# Altium project Basic_Board.PrjPcb
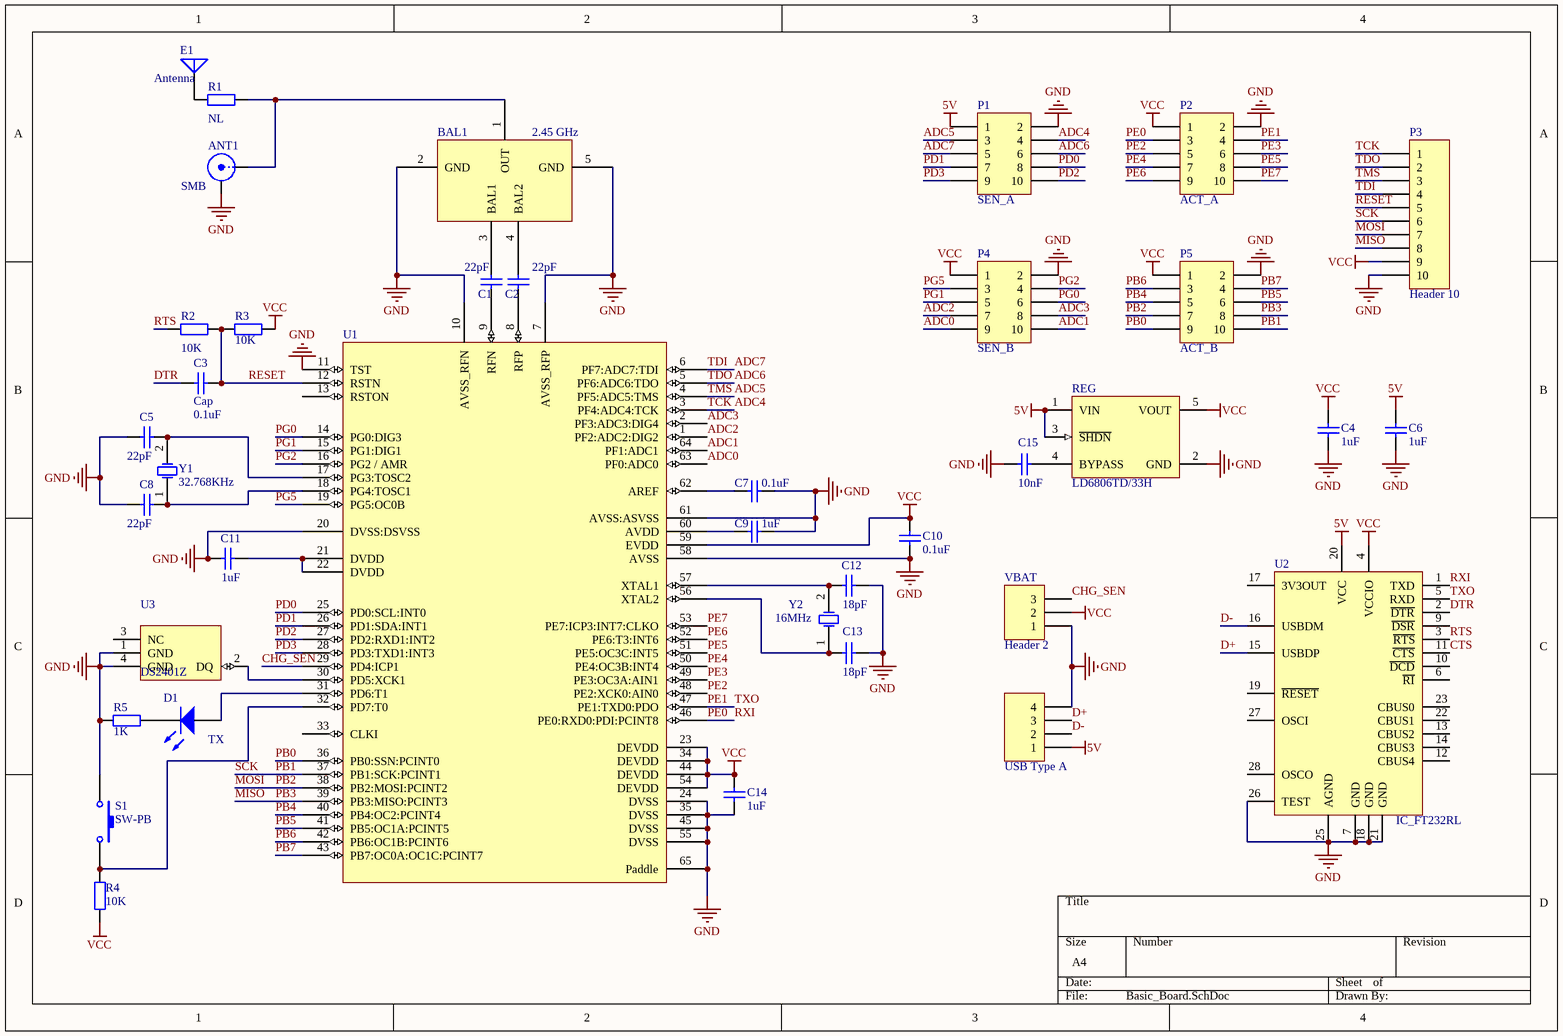
[diagram p0: Basic_Board.SchDoc]
1 sheet, 38 parts. Net scope: global (net labels, ports and power ports of the same name join across sheets).
Board file: Basic_Board.PcbDoc

## Sheet Basic_Board.SchDoc
size A4

### Parts
ANT1  SMB  [U.FL-R-SMT]
BAL1  2.45 GHz  [BALUN_SMD]
C1  value 22pF  [1608[0603]]  (hidden comment: Cap)
C2  value 22pF  [1608[0603]]  (hidden comment: Cap)
C3  Cap  value 0.1uF  [1608[0603]]
C4  value 1uF  [1608[0603]]  (hidden comment: Cap)
C5  value 22pF  [1608[0603]]  (hidden comment: Cap)
C6  value 1uF  [1608[0603]]  (hidden comment: Cap)
C7  value 0.1uF  [1608[0603]]  (hidden comment: Cap)
C8  value 22pF  [1608[0603]]  (hidden comment: Cap)
C9  value 1uF  [1608[0603]]  (hidden comment: Cap)
C10  value 0.1uF  [1608[0603]]  (hidden comment: Cap)
C11  value 1uF  [1608[0603]]  (hidden comment: Cap)
C12  value 18pF  [1608[0603]]  (hidden comment: Cap)
C13  value 18pF  [1608[0603]]  (hidden comment: Cap)
C14  value 1uF  [1608[0603]]  (hidden comment: Cap)
C15  value 10nF  [1608[0603]]  (hidden comment: Cap)
D1  TX  [3015[1206]]
E1  Antenna  [Antennas 2.4G SMD MOLEX]
P1  SEN_A  [HDR2X5_Female_Slim]
P2  ACT_A  [HDR2X5_Female_Slim]
P3  Header 10  [HDR1X10]
P4  SEN_B  [HDR2X5_Female_Slim]
P5  ACT_B  [HDR2X5_Female_Slim]
P7  USB Type A  [USBA_SMD]
R1  value NL  [1608[0603]]  (hidden comment: Res2)
R2  value 10K  [1608[0603]]  (hidden comment: Res2)
R3  value 10K  [1608[0603]]  (hidden comment: Res2)
R4  value 10K  [1608[0603]]  (hidden comment: Res2)
R5  value 1K  [1608[0603]]  (hidden comment: Res2)
REG  LD6806TD/33H  [DBV005_N]
S1  SW-PB  [BUTTON SWITCH]
U1  ATmega128RFA1-DE  [MLF64-M2]  (value not drawn)
U2  IC_FT232RL  [SSOP-28]
U3  DS2401Z  [SOT-223]
VBAT  Header 2  [HDR1X3]
Y1  32.768KHz  [Crystal]
Y2  16MHz  [CrystalSMD TSX3225]

### Nets
5V: C6.1 P1.1 P7.1 REG.1(VIN) REG.3(~{SHDN}) U2.20(VCC)
GND: ANT1.2(Y) BAL1.2(GND) BAL1.5(GND) C4.1 C5.2 C6.2 C7.2 C8.2 C9.2 C10.2 C11.1 C12.1 C13.1 C14.2 C15.1 P1.2 P2.2 P3.10 P4.2 P5.2 P7.4 R5.2 REG.2(GND) S1.1 U1.7(AVSS_RFP) U1.10(AVSS_RFN) U1.11(TST) U1.20(DVSS:DSVSS) U1.24(DVSS) U1.35(DVSS) U1.45(DVSS) U1.55(DVSS) U1.58(AVSS) U1.61(AVSS:ASVSS) U1.65(Paddle) U2.7(GND) U2.18(GND) U2.21(GND) U2.25(AGND) U2.26(TEST) U3.1(GND) U3.4(GND) VBAT.1
NC: U2.8(NC) U2.24(NC)
VCC: C4.2 C10.1 C14.1 P2.1 P3.9 P4.1 P5.1 R3.2 R4.1 REG.5(VOUT) U1.23(DEVDD) U1.34(DEVDD) U1.44(DEVDD) U1.54(DEVDD) U1.59(EVDD) U2.4(VCCIO) VBAT.2
ADC0: P4.9 U1.63(PF0:ADC0)
ADC1: P4.10 U1.64(PF1:ADC1)
ADC2: P4.7 U1.1(PF2:ADC2:DIG2)
ADC3: P4.8 U1.2(PF3:ADC3:DIG4)
ADC4: P1.4 P3.1 U1.3(PF4:ADC4:TCK)  [also labelled TCK]
ADC5: P1.3 P3.3 U1.4(PF5:ADC5:TMS)  [also labelled TMS]
ADC6: P1.6 P3.2 U1.5(PF6:ADC6:TDO)  [also labelled TDO]
ADC7: P1.5 P3.4 U1.6(PF7:ADC7:TDI)  [also labelled TDI]
CHG_SEN: U1.29(PD4:ICP1) VBAT.3
CTS: U2.11(~{CTS})
D+: P7.3 U2.15(USBDP)
D-: P7.2 U2.16(USBDM)
DTR: C3.1 U2.2(~{DTR})
MISO: P3.8 P5.8 U1.39(PB3:MISO:PCINT3)  [also labelled PB3]
MOSI: P3.7 P5.7 U1.38(PB2:MOSI:PCINT2)  [also labelled PB2]
PB0: P5.9 U1.36(PB0:SSN:PCINT0)
PB1: P3.6 P5.10 U1.37(PB1:SCK:PCINT1)  [also labelled SCK]
PB4: P5.5 U1.40(PB4:OC2:PCINT4)
PB5: P5.6 U1.41(PB5:OC1A:PCINT5)
PB6: P5.3 U1.42(PB6:OC1B:PCINT6)
PB7: P5.4 U1.43(PB7:OC0A:OC1C:PCINT7)
PD0: P1.8 U1.25(PD0:SCL:INT0)
PD1: P1.7 U1.26(PD1:SDA:INT1)
PD2: P1.10 U1.27(PD2:RXD1:INT2)
PD3: P1.9 U1.28(PD3:TXD1:INT3)
PE0: P2.3 U1.46(PE0:RXD0:PDI:PCINT8) U2.1(TXD)  [also labelled RXI]
PE1: P2.4 U1.47(PE1:TXD0:PDO) U2.5(RXD)  [also labelled TXO]
PE2: P2.5 U1.48(PE2:XCK0:AIN0)
PE3: P2.6 U1.49(PE3:OC3A:AIN1)
PE4: P2.7 U1.50(PE4:OC3B:INT4)
PE5: P2.8 U1.51(PE5:OC3C:INT5)
PE6: P2.9 U1.52(PE6:T3:INT6)
PE7: P2.10 U1.53(PE7:ICP3:INT7:CLKO)
PG0: P4.6 U1.14(PG0:DIG3)
PG1: P4.5 U1.15(PG1:DIG1)
PG2: P4.4 U1.16(PG2_/_AMR)
PG5: P4.3 U1.19(PG5:OC0B)
RESET: C3.2 P3.5 R2.1 R3.1 U1.12(RSTN)
RTS: R2.2 U2.3(~{RTS})
NetANT1_1: ANT1.1(X) BAL1.1(OUT) R1.2
NetBAL1_3: BAL1.3(BAL1) C1.2
NetBAL1_4: BAL1.4(BAL2) C2.2
NetC1_1: C1.1 U1.9(RFN)
NetC2_1: C2.1 U1.8(RFP)
NetC5_1: C5.1 U1.17(PG3:TOSC2) Y1.2(OSC2)
NetC7_1: C7.1 U1.62(AREF)
NetC8_1: C8.1 U1.18(PG4:TOSC1) Y1.1(OSC1)
NetC9_1: C9.1 U1.60(AVDD)
NetC11_2: C11.2 U1.21(DVDD) U1.22(DVDD)
NetC12_2: C12.2 U1.57(XTAL1) Y2.2(OSC2)
NetC13_2: C13.2 U1.56(XTAL2) Y2.1(OSC1)
NetC15_2: C15.2 REG.4(BYPASS)
NetD1_1: D1.1 U1.31(PD6:T1)
NetD1_2: D1.2 R5.1
NetE1_1: E1.1(A) R1.1
NetR4_2: R4.2 S1.2 U1.32(PD7:T0)
NetU1_30: U1.30(PD5:XCK1) U3.2(DQ)

Not connected (* = marked no-connect by the designer): U1 13(RSTON) 33(CLKI); U2 6(~{RI}) 9(~{DSR}) 10(~{DCD}) 12(CBUS4) 13(CBUS2) 14(CBUS3) 17(3V3OUT) 19(~{RESET}) 22(CBUS1) 23(CBUS0) 27(OSCI) 28(OSCO); U3 3(NC)

### Library data of the parts
ANT1 = SMB: SMB Straight Connector; LatestRevisionDate: 17-Jul-2002; LatestRevisionNote: Re-released for DXP Platform.; Publisher: Altium Limited
BAL1 = BALUN
C1-C15 = Cap: Capacitor; Published: 8-Jun-2000; LatestRevisionDate: 17-Jul-2002; LatestRevisionNote: Re-released for DXP Platform.; PackageReference: RAD-0.3; Publisher: Altium Limited
D1 = LED SMD (0603)
E1 = Antenna: Generic Antenna; Published: 24-Mar-1999; LatestRevisionDate: 17-Jul-2002; LatestRevisionNote: Re-released for DXP Platform.; PackageReference: PIN1; Publisher: Altium Limited
P1 P2 P4 P5 = Header 5X2: Header, 5-Pin, Dual row; LatestRevisionDate: 17-Jul-2002; LatestRevisionNote: Re-released for DXP Platform.; Publisher: Altium Limited
P3 = Header 10: Header, 10-Pin; LatestRevisionDate: 17-Jul-2002; LatestRevisionNote: Re-released for DXP Platform.; Publisher: Altium Limited
P7 = Header 4: Header, 4-Pin; LatestRevisionDate: 17-Jul-2002; LatestRevisionNote: Re-released for DXP Platform.; Publisher: Altium Limited
R1-R5 = Res2: Resistor; Published: 8-Jun-2000; LatestRevisionDate: 17-Jul-2002; LatestRevisionNote: Re-released for DXP Platform.; PackageReference: AXIAL-0.4; Publisher: Altium Limited
REG = TC1014-1.8VCT713: 50 mA, 100 mA and 150 mA CMOS LDOs with Active-Low Shutdown and Reference Bypass, 5-Pin SOT-23, Extended Temperature, Tape and Reel; FirstPublished: 29-Jan-2009; DatasheetVersion: revE, Feb-2007; PackageVersion: revBB, Aug-2009; PackageReference: SOT-23-CT5; Publisher: Altium Limited; PackageDescription: 5-Lead Plastic Small Outline Transistor (CT) [SOT-23]; Supplier 1: Digi-Key; Supplier Part Number 1: TC10141.8VCT713TR-ND; Supplier 2: Digi-Key; Supplier Part Number 2: TC10141.8VCT713CT-ND; Supplier 3: Digi-Key; Supplier Part Number 3: TC10141.8VCT713DKR-ND; Supplier 4: Farnell; Supplier Part Number 4: 1331500; Supplier 5: Newark; Supplier Part Number 5: 27C9045; Code_IPC: SOT23-5; ComponentLink1Description: Datasheet; ComponentLink1URL: http://ww1.microchip.com/downloads/en/DeviceDoc/21335e.pdf; ComponentLink2Description: Packaging Specification; ComponentLink2URL: http://www.microchip.com/stellent/groups/techpub_sg/documents/packagingspec/en012702.pdf; ComponentLink3Description: Microchip.com Home; ComponentLink3URL: http://www.microchip.com/
S1 = SW-PB: Switch; Published: 24-Mar-1999; LatestRevisionDate: 17-Jul-2002; LatestRevisionNote: Re-released for DXP Platform.; PackageReference: SPST-2; Publisher: Altium Limited
U1 = ATmega128RFA1-DE: 802.15.4 compliant AVR transceiver; verified by: vlarsen; verified date: 2010-12-05; Status: Verified
U2 = IC_FT232RL: FT232R USB UART; Manufacturer: *; Note: *; ManufacturerPartNo: *
U3 = DS2401Z: Silicon Serial Number; Note: Pin number 3 is Not Connected (NC); Published: 13-Oct-2000; LatestRevisionDate: 17-Jul-2002; LatestRevisionNote: Re-released for DXP Platform.; DatasheetVersion: 21-Oct-1999; PackageVersion: Feb-1999; PackageReference: SOT-223; Publisher: Altium Limited; PackageDescription: SOT-223/SC-73; 4 Leads; Body 6.7 x 7.3 mm, inc. leads (LxW max); ComponentLink1Description: Manufacturer Link; ComponentLink1URL: http://www.maxim-ic.com/; ComponentLink2Description: Datasheet; ComponentLink2URL: http://pdfserv.maxim-ic.com/en/ds/DS2401.pdf
VBAT = Header 3: Header, 3-Pin; LatestRevisionDate: 17-Jul-2002; LatestRevisionNote: Re-released for DXP Platform.; Publisher: Altium Limited
Y1 = XTAL: Crystal Oscillator; Published: 8-Jun-2000; LatestRevisionDate: 17-Jul-2002; LatestRevisionNote: Re-released for DXP Platform.; PackageReference: R38; Publisher: Altium Limited
Y2 = XTAL: Crystal Oscillator; pin to pad: 2>3; Published: 8-Jun-2000; LatestRevisionDate: 17-Jul-2002; LatestRevisionNote: Re-released for DXP Platform.; PackageReference: R38; Publisher: Altium Limited